# Altium schematic sheet Ux.SchDoc
size A4; SheetNumber: 4; SheetTotal: 6
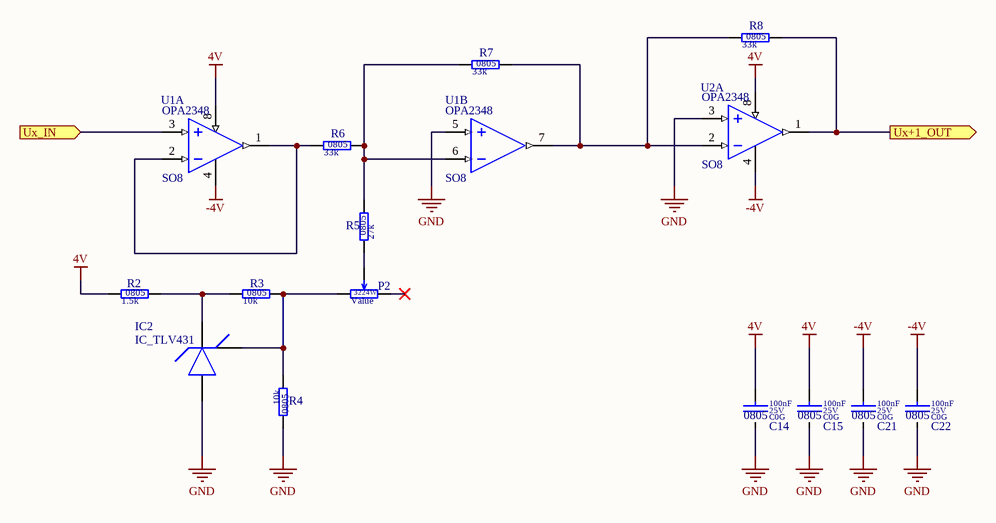
[diagram p0: Ux.SchDoc]

## Parts
C14  value 100nF  Dielectric: C0G  Voltage: 25V  SCH_Footprint: 0805  [C_0805_2012]  (hidden comment: C_100nF_0805_C0G_25V_5)
C15  value 100nF  Dielectric: C0G  Voltage: 25V  SCH_Footprint: 0805  [C_0805_2012]  (hidden comment: C_100nF_0805_C0G_25V_5)
C21  value 100nF  Dielectric: C0G  Voltage: 25V  SCH_Footprint: 0805  [C_0805_2012]  (hidden comment: C_100nF_0805_C0G_25V_5)
C22  value 100nF  Dielectric: C0G  Voltage: 25V  SCH_Footprint: 0805  [C_0805_2012]  (hidden comment: C_100nF_0805_C0G_25V_5)
IC2  IC_TLV431  [SOT23]
P2  SCH_Footprint: 3224W  [Potentiometer]  (hidden comment: POT)
R2  SCH_Footprint: 0805  Resistance: 1.5k  [R_0805_2012]  (hidden comment: R_1.5k_0805_5_1)
R3  SCH_Footprint: 0805  Resistance: 10k  [R_0805_2012]  (hidden comment: R_10k_0805_5)
R4  SCH_Footprint: 0805  Resistance: 10k  [R_0805_2012]  (hidden comment: R_10k_0805_5)
R5  SCH_Footprint: 0805  Resistance: 27k  [R_0805_2012]  (hidden comment: R_27k_0805_5)
R6  SCH_Footprint: 0805  Resistance: 33k  [R_0805_2012]  (hidden comment: R_33k_0805_5)
R7  SCH_Footprint: 0805  Resistance: 33k  [R_0805_2012]  (hidden comment: R_33k_0805_5)
R8  SCH_Footprint: 0805  Resistance: 33k  [R_0805_2012]  (hidden comment: R_33k_0805_5)
U1  value OPA2348  [SO8]  (hidden comment: A2_OPA2348)  (parts A,B of 2)
U2  value OPA2348  [SO8]  (hidden comment: A2_OPA2348)  (part A of 2)

## Ports
Ux+1_OUT (out), Ux_IN (in)

## Nets
4V: C14.1 C15.1 R2.1 U1.8(VDD) U2.8(VDD)
-4V: C21.1 C22.1 U1.4(GND) U2.4(GND)
GND: C14.2 C15.2 C21.2 C22.2 IC2.3(ANODE) R4.2 U1.5(IN+2) U2.3(IN+1)
Ux+1_OUT: R8.2 U2.1(OUT1) ; port Ux+1_OUT
Ux_IN: U1.3(IN+1) ; port Ux_IN
NetIC2_1: IC2.1(REF) P2.1 R3.2 R4.1
NetIC2_2: IC2.2(CATH) R2.2 R3.1
NetP2_2: P2.2 R5.1
NetR5_2: R5.2 R6.2 R7.1 U1.6(IN-2)
NetR6_1: R6.1 U1.1(OUT1) U1.2(IN-1)
NetR7_2: R7.2 R8.1 U1.7(OUT2) U2.2(IN-1)

Not connected (* = marked no-connect by the designer): P2 3*

## Library data of the parts
C14 C15 C21 C22 = C_100nF_0805_C0G_25V_5: Capacitor
R2 = R_1.5k_0805_5_1: Tolerance: 5
R3 R4 = R_10k_0805_5: Tolerance: 5
R5 = R_27k_0805_5: Tolerance: 5
R6-R8 = R_33k_0805_5: Tolerance: 5
P2 = POT: Value: Value
U1 U2 = A2_OPA2348: SCH_Footprint: SO8